# EAGLE design 10bit-adc-and-dac-v2 (EAGLE 8.6.0)
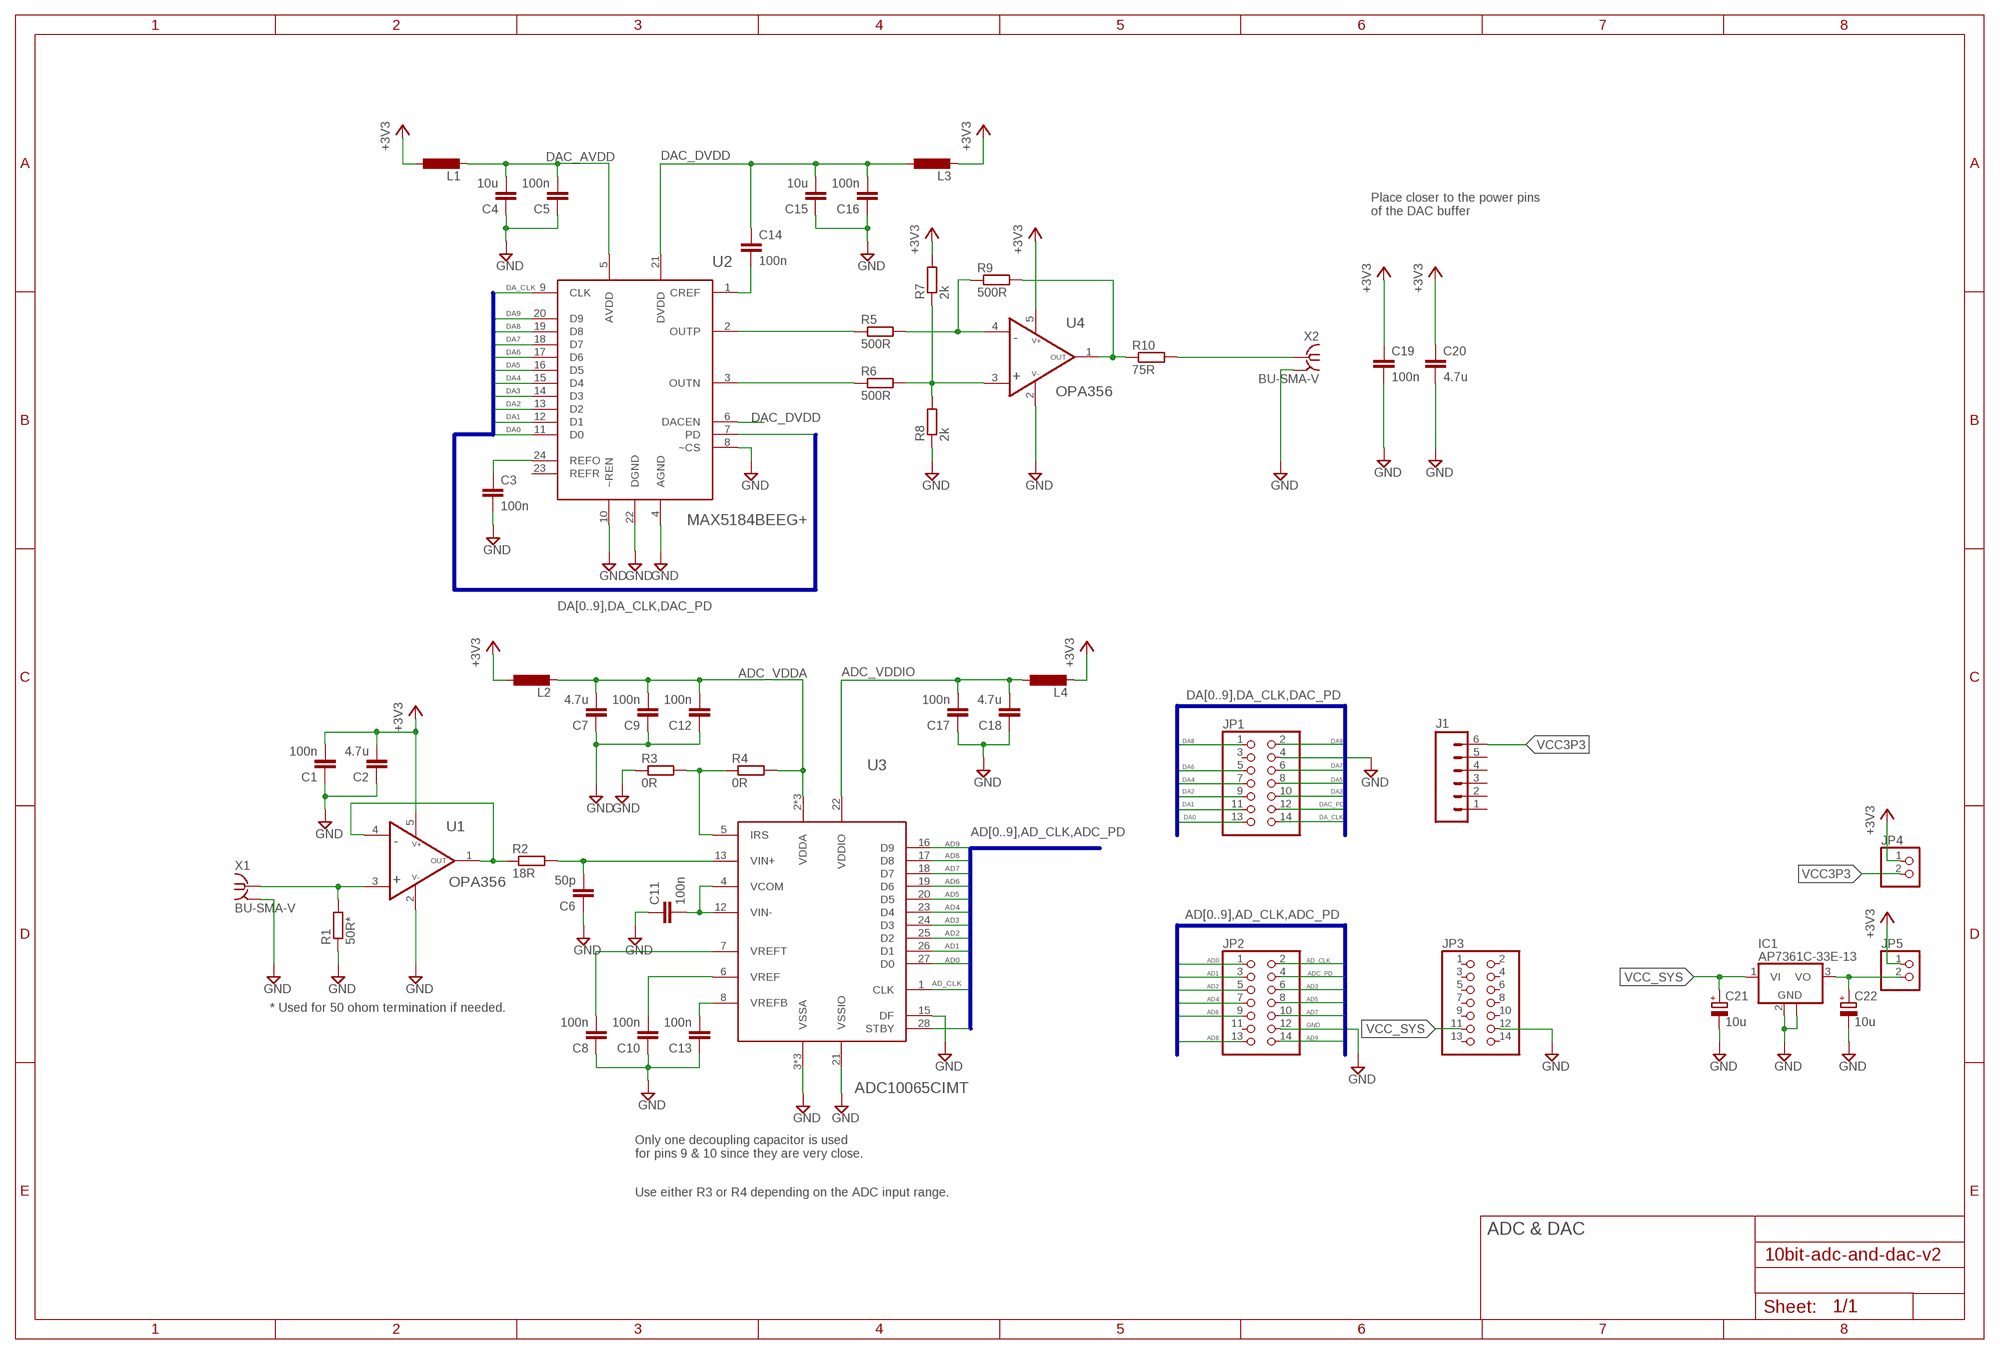
[diagram p0: schematic, sheet 1]

## Parts
C1  100n  C-EUC0805  [C0805]
C2  4.7u  C-EUC0805  [C0805]
C3  100n  C-EUC0805  [C0805]
C4  10u  C-EUC0805  [C0805]
C5  100n  C-EUC0805  [C0805]
C6  50p  C-EUC0805  [C0805]
C7  4.7u  C-EUC0805  [C0805]
C8  100n  C-EUC0805  [C0805]
C9  100n  C-EUC0805  [C0805]
C10  100n  C-EUC0805  [C0805]
C11  100n  C-EUC0805  [C0805]
C12  100n  C-EUC0805  [C0805]
C13  100n  C-EUC0805  [C0805]
C14  100n  C-EUC0805  [C0805]
C15  10u  C-EUC0805  [C0805]
C16  100n  C-EUC0805  [C0805]
C17  100n  C-EUC0805  [C0805]
C18  4.7u  C-EUC0805  [C0805]
C19  100n  C-EUC0805  [C0805]
C20  4.7u  C-EUC0805  [C0805]
C21  10u  CPOL-EUCT3528  [CT3528]
C22  10u  CPOL-EUCT3528  [CT3528]
IC1  AP7361C-33E-13  UA78M33DCY  [SOT223]
J1  M06SILK_FEMALE_PTH  [1X06]
JP1  PINHD-2X7  [2X07]
JP2  PINHD-2X7  [2X07]
JP3  PINHD-2X7  [2X07]
JP4  PINHD-1X2  [1X02]
JP5  PINHD-1X2  [1X02]
L1  L-EUL2012C  [L2012C]
L2  L-EUL2012C  [L2012C]
L3  L-EUL2012C  [L2012C]
L4  L-EUL2012C  [L2012C]
R1  50R*  R-EU_R0805  [R0805]
R2  18R  R-EU_R0805  [R0805]
R3  0R  R-EU_R0805  [R0805]
R4  0R  R-EU_R0805  [R0805]
R5  500R  R-EU_R0805  [R0805]
R6  500R  R-EU_R0805  [R0805]
R7  2k  R-EU_R0805  [R0805]
R8  2k  R-EU_R0805  [R0805]
R9  500R  R-EU_R0805  [R0805]
R10  75R  R-EU_R0805  [R0805]
U1  OPA356  [SOT23-5L]
U2  MAX5184BEEG+  [SOP63P600X175-24N]
U3  ADC10065CIMT  [TSSOP28]
U4  OPA356  [SOT23-5L]
X1  BU-SMA-V  [BU-SMA-V]
X2  BU-SMA-V  [BU-SMA-V]

## Nets
+3V3: C1.2 C2.2 C19.1 C20.1 JP4.1 JP5.1 L1.1 L2.1 L3.2 L4.2 R7.2 U1.5(V+) U4.5(V+)
AD0: JP2.1 U3.27(D0)
AD1: JP2.3 U3.26(D1)
AD2: JP2.5 U3.25(D2)
AD3: JP2.6 U3.24(D3)
AD4: JP2.7 U3.23(D4)
AD5: JP2.8 U3.20(D5)
AD6: JP2.9 U3.19(D6)
AD7: JP2.10 U3.18(D7)
AD8: JP2.13 U3.17(D8)
AD9: JP2.14 U3.16(D9)
AD_CLK: JP2.2 U3.1(CLK)
ADC_PD: JP2.4 U3.28(STBY)
ADC_VDDA: C7.2 C9.2 C12.2 L2.2 R4.2 U3.2(VDDA) U3.9(VDDA) U3.10(VDDA)
ADC_VDDIO: C17.2 C18.2 L4.1 U3.22(VDDIO)
DA0: JP1.13 U2.11(D0)
DA1: JP1.11 U2.12(D1)
DA2: JP1.9 U2.13(D2)
DA3: JP1.10 U2.14(D3)
DA4: JP1.7 U2.15(D4)
DA5: JP1.8 U2.16(D5)
DA6: JP1.5 U2.17(D6)
DA7: JP1.6 U2.18(D7)
DA8: JP1.1 U2.19(D8)
DA9: JP1.2 U2.20(D9)
DA_CLK: JP1.14 U2.9(CLK)
DAC_AVDD: C4.2 C5.2 L1.2 U2.5(AVDD)
DAC_DVDD: C14.1 C15.2 C16.2 L3.1 U2.6(DACEN) U2.21(DVDD)
DAC_PD: JP1.12 U2.7(PD)
GND: C1.1 C2.1 C3.2 C4.1 C5.1 C6.1 C7.1 C8.1 C9.1 C10.1 C11.1 C12.1 C13.1 C15.1 C16.1 C17.1 C18.1 C19.2 C20.2 C21.- C22.- IC1.2(GND) IC1.4(GND) JP1.4 JP2.12 JP3.12 R1.1 R3.1 R8.1 U1.2(V-) U2.4(AGND) U2.8(~CS) U2.10(~REN) U2.22(DGND) U3.3(VSSA) U3.11(VSSA) U3.14(VSSA) U3.15(DF) U3.21(VSSIO) U4.2(V-) X1.2 X1.3 X1.4 X1.5 X2.2 X2.3 X2.4 X2.5
N$2: R2.1 U1.1(OUT) U1.4(IN-)
N$3: R10.2 X2.1
N$4: R1.2 U1.3(IN+) X1.1
N$5: C22.+ IC1.3(VO) JP5.2
N$6: R3.2 R4.1 U3.5(IRS)
N$7: C13.2 U3.8(VREFB)
N$8: C6.2 R2.2 U3.13(VIN+)
N$11: C10.2 U3.6(VREF)
N$13: C3.1 U2.24(REFO)
N$14: C14.2 U2.1(CREF)
N$15: C8.2 U3.7(VREFT)
N$18: C11.2 U3.4(VCOM) U3.12(VIN-)
N$19: R9.2 R10.1 U4.1(OUT)
N$23: R6.2 R7.1 R8.2 U4.3(IN+)
N$24: R5.2 R9.1 U4.4(IN-)
N$25: R5.1 U2.2(OUTP)
N$26: R6.1 U2.3(OUTN)
VCC3P3: J1.6 JP4.2
VCC_SYS: C21.+ IC1.1(VI) JP3.11
Unconnected: J1.1 J1.2 J1.3 J1.4 J1.5 JP1.3 JP2.11 JP3.1 JP3.2 JP3.3 JP3.4 JP3.5 JP3.6 JP3.7 JP3.8 JP3.9 JP3.10 JP3.13 JP3.14 U2.23(REFR)

## Buses
AD[0..9],AD_CLK,ADC_PD
DA[0..9],DA_CLK,DAC_PD

## Notes on the sheet
- Place closer to the power pins
  of the DAC buffer
- * Used for 50 ohom termination if needed.
- Only one decoupling capacitor is used
  for pins 9 & 10 since they are very close.
- Use either R3 or R4 depending on the ADC input range.
- ADC & DAC

## Library data of the parts
C1-C20 = resistor:C-EU: CAPACITOR, European symbol
C21 C22 = rcl:CPOL-EU: POLARIZED CAPACITOR, European symbol; SPICEPREFIX: C
IC1 = linear:UA78M*: POSITIVE-VOLTAGE REGULATORS Source: http://focus.ti.com/lit/ds/symlink/ua78m33.pdf; MF: Diodes Incorporated; MPN: AP7361C-33E-13
J1 = SparkFun-Connectors:M06: Header 6 Standard 6-pin 0.1" header. Use with straight break away headers (SKU : PRT-00116), right angle break away headers (PRT-00553), swiss pins (PRT-00743), machine pins (PRT-00117), and female headers (PRT-00115). Molex polarized connector foot print use with SKU : PRT-08094 with associated crimp pins and housings. NOTES ON THE VARIANTS LOCK and LOCK_LONGPADS... This footprint was designed to help hold the alignment of a through-hole component (i.e. 6-pin header) while soldering it into place. You may notice that each hole has been shifted either up or down by 0.005 of an inch from it's more standard position (which is a perfectly straight line). This slight alteration caused the pins (the squares in the middle) to touch the edges of the holes. Because they are alternating, it causes a "brace" to hold the component in place. 0.005 has proven to be the perfect amount of "off-center" position when using our standard breakaway headers. Although looks a little odd when you look at the bare footprint, once you have a header in there, the alteration is very hard to notice. Also,if you push a header all the way into place, it is covered up entirely on the bottom side. This idea of altering the position of holes to aid alignment will be further integrated into the Sparkfun Library for other footprints. It can help hold any component with 3 or more connection pins.; PROD_ID: CONN-08437
JP1-JP3 = pinhead+:PINHD-2X7: PIN HEADER
JP4 JP5 = pinhead+:PINHD-1X2: PIN HEADER
L1-L4 = resistor:L-EU: INDUCTOR, European symbol; MPN: CIM21J252NE
R1-R10 = resistor:R-EU_: RESISTOR, European symbol
U1 U4 = misc-parts:OPA356: OPAMP; MF: TI; MPN: OPA356AIDBVR
U2 = misc-parts:MAX5184: 10-Bit, 40MHz, Current/Voltage-Output DACs; MF: MAXIM; MPN: MAX5184BEEG+
U3 = misc-parts:ADC10065: 10-Bit, 65-MSPS Analog-to-Digital Converter (ADC); MF: TI; MPN: ADC10065CIMTX/NOPB
X1 X2 = con-coax:BU-SMA-V: FEMALE SMA CONNECTOR Radiall distributor RS 112-3794; MF: TE Connectivity; MPN: 5-1814832-1; OC_FARNELL: unknown; OC_NEWARK: unknown

## Board
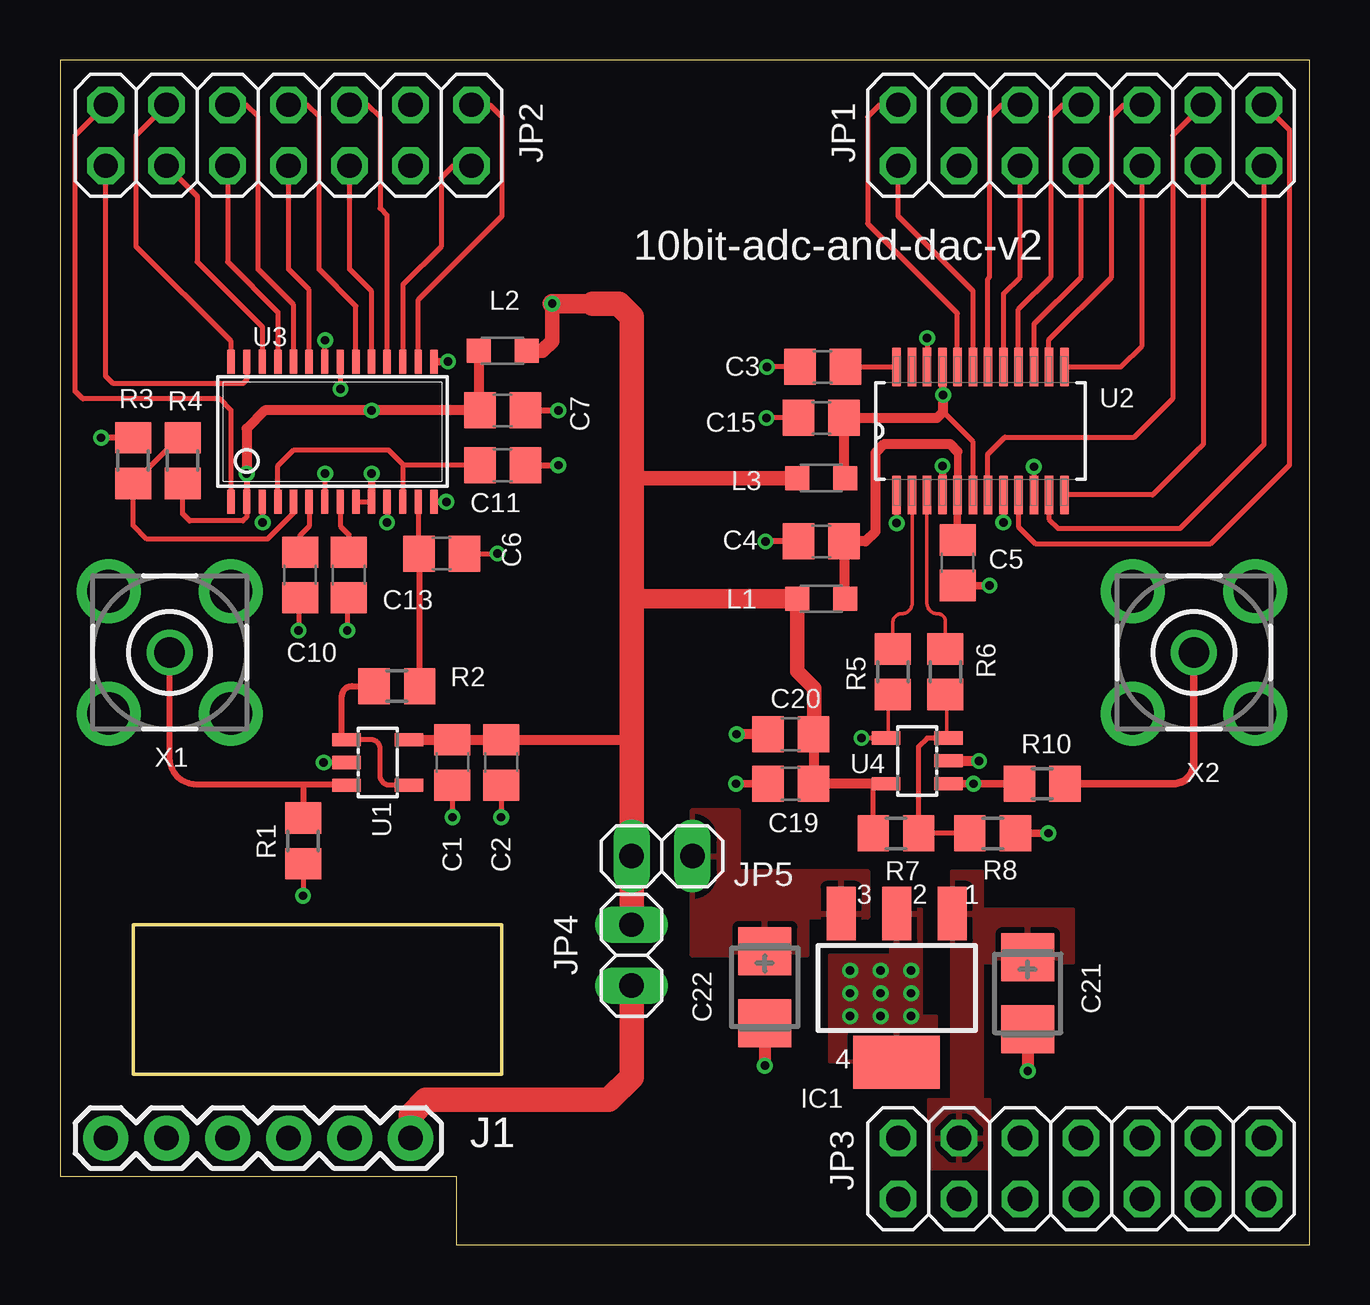
[diagram p1: board, top side]
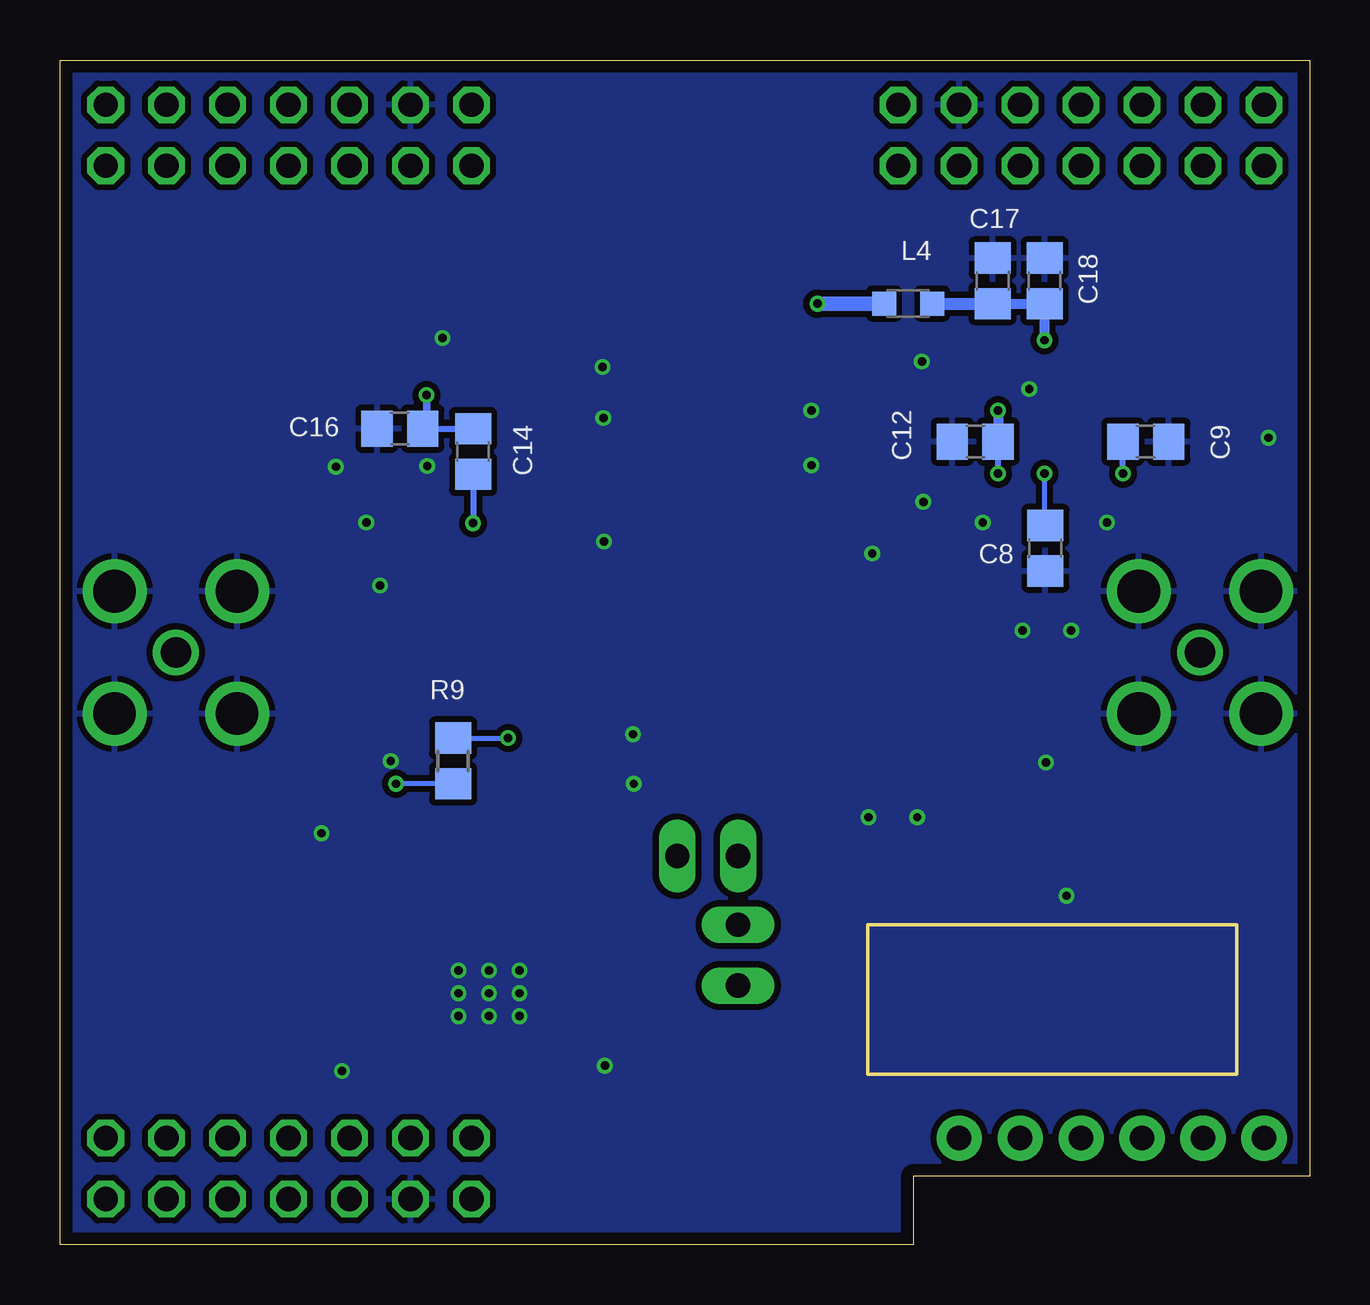
[diagram p2: board, bottom side, seen from below]

Size 52.07 x 49.36 mm. Coordinates in mm from the lower left corner, seen from the top.
Outline: 0,2.86 16.51,2.86 16.51,0 52.07,0 52.07,49.37 0,49.37 0,2.86
Copper layers (1*16): Top 0.035mm / dielectric 1.6mm / Bottom 0.035mm
Design rules "Elecrow-2-layer_PCB_eagle_rule *": minimum track width 6mil, minimum drill 12mil, track to track 6mil, track to pad 8mil, pad to pad 8mil, via to via 12mil, smd to smd 0mil, copper to edge 20mil, drill to drill 10mil, minimum pad ring 6mil, minimum via ring 6mil, stop-mask expansion 0mil, vias tented up to drill 100mil, thermal gap 10mil
Milling: area 3,7.1 to 18.4,13.3

### Footprints (pad centres in the part's own frame; a part is rotated, then mirrored left to right if it is on the bottom)
C0805 = smd 1.3 x 1.5: 1 -0.95,0; 2 0.95,0
CT3528 = smd 2 x 2.2: + -1.5,0; - 1.5,0
SOT223 = smd 1.219 x 2.235: 1 -2.311,-3.099; 2 0,-3.099; 3 2.311,-3.099 | smd 3.6 x 2.2: 4 0,3.099
1X06 = drill 1.016 pad 1.88: 1 0,0; 2 2.54,0; 3 5.08,0; 4 7.62,0; 5 10.16,0; 6 12.7,0
2X07 = drill 1.016 octagon: 1 -7.62,-1.27; 2 -7.62,1.27; 3 -5.08,-1.27; 4 -5.08,1.27; 5 -2.54,-1.27; 6 -2.54,1.27; 7 0,-1.27; 8 0,1.27; 9 2.54,-1.27; 10 2.54,1.27; 11 5.08,-1.27; 12 5.08,1.27; 13 7.62,-1.27; 14 7.62,1.27
1X02 = drill 1.016 long: 1 -1.27,0; 2 1.27,0
L2012C = smd 1 x 1: 1 -1,0; 2 1,0
R0805 = smd 1.3 x 1.5: 1 -0.95,0; 2 0.95,0
SOT23-5L = smd 0.55 x 1.2: 1 -0.95,-1.3; 2 0,-1.3; 3 0.95,-1.3; 4 0.95,1.3; 5 -0.95,1.3
SOP63P600X175-24N = smd 1.6 x 0.356: 1 -2.667,3.505; 2 -2.667,2.845; 3 -2.667,2.235; 4 -2.667,1.575; 5 -2.667,0.965; 6 -2.667,0.305; 7 -2.667,-0.305; 8 -2.667,-0.965; 9 -2.667,-1.575; 10 -2.667,-2.235; 11 -2.667,-2.845; 12 -2.667,-3.505; 13 2.667,-3.505; 14 2.667,-2.845; 15 2.667,-2.235; 16 2.667,-1.575; 17 2.667,-0.965; 18 2.667,-0.305; 19 2.667,0.305; 20 2.667,0.965; 21 2.667,1.575; 22 2.667,2.235; 23 2.667,2.845; 24 2.667,3.505
TSSOP28 = smd 0.305 x 0.991: 1 -4.225,-2.918; 2 -3.575,-2.918; 3 -2.925,-2.918; 4 -2.275,-2.918; 5 -1.625,-2.918; 6 -0.975,-2.918; 7 -0.325,-2.918; 8 0.325,-2.918; 9 0.975,-2.918; 10 1.625,-2.918; 11 2.275,-2.918; 12 2.925,-2.918; 13 3.575,-2.918; 14 4.225,-2.918; 15 4.225,2.918; 16 3.575,2.918; 17 2.925,2.918; 18 2.275,2.918; 19 1.625,2.918; 20 0.975,2.918; 21 0.325,2.918; 22 -0.325,2.918; 23 -0.975,2.918; 24 -1.625,2.918; 25 -2.275,2.918; 26 -2.925,2.918; 27 -3.575,2.918; 28 -4.225,2.918
BU-SMA-V = drill 1.27: 1 0,0 | drill 1.778: 2 -2.55,2.55; 3 2.55,2.55; 4 2.55,-2.55; 5 -2.55,-2.55

### Placement (x,y rotation side)
C1  16.35,20.1 90 top
C2  18.38,20.1 90 top
C3  31.78,36.58 180 top
C4  31.72,29.31 0 top
C5  37.4,28.42 90 top
C6  15.91,28.8 180 top
C7  18.45,34.77 180 top
C8  11.02,29.02 90 bottom
C9  6.83,33.46 180 bottom
C10  10,27.91 90 top
C11  18.45,32.48 180 top
C12  13.94,33.46 0 bottom
C13  12.03,27.91 90 top
C14  34.86,33.05 270 bottom
C15  31.72,34.45 0 top
C16  37.91,34 0 bottom
C17  13.21,40.16 270 bottom
C18  11.05,40.16 270 bottom
C19  30.45,19.21 180 top
C20  30.45,21.27 180 top
C21  40.32,10.48 270 top
C22  29.37,10.73 270 top
IC1  34.86,10.7 180 top
J1  1.91,4.45 0 top
JP1  42.55,46.23 0 top
JP2  9.53,46.23 0 top
JP3  42.55,3.17 180 top
JP4  23.81,12.06 270 top
JP5  25.08,16.19 0 top
L1  31.72,26.92 0 top
L2  18.45,37.24 180 top
L3  31.72,31.94 180 top
L4  16.73,39.21 180 bottom
R1  10.13,16.83 90 top
R2  14.03,23.27 0 top
R3  3.05,32.67 270 top
R4  5.11,32.67 270 top
R5  34.7,23.88 270 top
R6  36.89,23.88 270 top
R7  34.83,17.14 180 top
R8  38.86,17.14 180 top
R9  35.69,20.16 270 bottom
R10  40.93,19.21 0 top
U1  13.24,20.1 270 top
U2  38.35,33.91 90 top
U3  11.36,33.88 0 top
U4  35.72,20.16 90 top
X1  4.57,24.68 0 top
X2  47.24,24.68 0 top

### Tracks (layer width: path | path; a pad name or v marks a point on that pad's centre or on a via)
+3V3  (via drill 0.35)
  Top 0.203: R7.2 33.88,19.12 33.97,19.21
  Top 0.406: U1.5 C1.2 C2.2 23.72,21.05 arc-90 23.81,20.95 | C19.1 31.56,19.21 | C19.1 33.97,19.21 U4.5 | C19.1 | C20.1 C19.1
  Top 0.61: L2.1 20.1,37.24 20.51,37.66 v20.51,39.21 | L3.2 23.81,31.94 23.81,32.07 | L1.1 30.72,23.89 31.43,23.18 31.43,21.31 C20.1
  Top 0.813: v20.51,39.21 22.19,39.21 | 23.94,31.94 23.81,32.07 | L1.1 23.88,26.92 23.81,26.99
  Top 1.016: 22.19,39.21 23.27,39.21 23.81,38.67 23.81,32.07 23.81,26.99 23.81,20.95 JP5.1 JP4.1
  Bottom 0.61: L4.2 v20.51,39.21
AD0
  Top 0.203: JP2.1 1.91,36.2 2.22,35.88 7.62,35.88 7.78,36.04 U3.27
AD1
  Top 0.203: U3.26 8.43,38.24 5.71,40.96 5.71,43.69 JP2.3
AD2
  Top 0.203: U3.25 9.08,38.86 6.99,40.96 JP2.5
AD3
  Top 0.203: JP2.6 7.75,47.5 8.26,46.99 8.26,40.64 9.73,39.16 U3.24
AD4
  Top 0.203: U3.23 10.38,39.78 9.53,40.64 JP2.7
AD5
  Top 0.203: JP2.8 10.29,47.5 10.79,46.99 10.79,40.64 12.33,39.1 U3.20
AD6
  Top 0.203: U3.19 12.98,39.73 12.06,40.64 JP2.9
AD7
  Top 0.203: U3.18 13.63,42.88 13.34,43.18 13.34,46.99 12.83,47.5 JP2.10
AD8
  Top 0.203: JP2.13 16.38,44.96 15.88,44.45 15.88,41.59 14.29,40.01 U3.17
AD9
  Top 0.203: U3.16 14.93,39.38 18.41,42.86 18.41,46.99 17.91,47.5 JP2.14
AD_CLK
  Top 0.203: U3.1 7.13,34.78 6.67,35.24 0.95,35.24 0.64,35.56 0.64,46.23 JP2.2
ADC_PD
  Top 0.203: U3.28 7.13,37.64 3.17,41.59 3.17,46.23 JP2.4
ADC_VDDA  (via drill 0.35)
  Top 0.203: U3.9 U3.10 | 12.98,32.16 v12.99,32.13 | R4.2 5.11,30.45 5.4,30.16 7.62,30.16 7.78,30.32 U3.2
  Top 0.254: U3.2 v7.78,32.13
  Top 0.305: U3.10 12.98,32.16 | U3.2 | 17.52,34.79 C7.2
  Top 0.406: v7.78,32.13 7.78,34 8.54,34.77 v12.99,34.77 C7.2 17.45,34.82 L2.2
  Bottom 0.203: 12.99,32.16 v12.99,32.13
  Bottom 0.254: v7.78,32.13 C9.2 | 12.99,33.5 C12.2 12.99,33.49 v12.99,32.13
  Bottom 0.406: v12.99,34.77 12.99,33.5
ADC_VDDIO  (via drill 0.35)
  Top 0.203: U3.22 11.03,37.67 v11.05,37.69
  Bottom 0.406: v11.05,37.69 C18.2 C17.2
  Bottom 0.508: L4.1 C17.2
DA0
  Top 0.203: U2.11 41.2,30.24 41.59,29.84 46.67,29.84 48.26,31.43 48.58,31.75 50.16,33.34 JP1.13
DA1
  Top 0.203: U2.12 45.53,31.24 47.31,33.02 47.62,33.34 JP1.11
DA2
  Top 0.203: U2.13 44.2,36.58 45.09,37.47 JP1.9
DA3
  Top 0.203: JP1.10 44.32,47.5 43.81,46.99 43.81,40.32 41.2,37.71 U2.14
DA4
  Top 0.203: U2.15 40.59,38.37 42.55,40.32 JP1.7
DA5
  Top 0.203: U2.16 39.93,38.98 41.27,40.32 41.27,46.99 41.78,47.5 JP1.8
DA6
  Top 0.203: U2.17 39.32,39.64 40.01,40.32 JP1.5
DA7
  Top 0.203: JP1.6 39.24,47.5 38.73,46.99 38.73,40.32 38.66,40.25 U2.18
DA8
  Top 0.203: U2.19 38.05,39.74 34.92,42.86 JP1.1
DA9
  Top 0.203: U2.20 37.39,38.81 33.66,42.55 33.66,46.99 34.16,47.5 JP1.2
DA_CLK
  Top 0.203: JP1.14 51.23,46.43 51.23,32.5 47.94,29.21 40.64,29.21 39.93,29.92 U2.9
DAC_AVDD
  Top 0.203: U2.5 37.4,31.23
  Top 0.254: 37.4,31.24 U2.5 37.4,31.25
  Top 0.305: 37.4,31.23 | U2.5 37.37,31.26 | U2.5 C5.2 | 37.4,31.25 U2.5 | 37.4,33.05 37.4,31.25
  Top 0.406: 37.4,33.05 37.08,33.37 34.35,33.37 33.97,32.99 33.97,29.72 33.56,29.3 32.69,29.3 32.68,29.3 C4.2 32.67,26.97 L1.2
DAC_DVDD  (via drill 0.35)
  Top 0.203: U2.6 38.05,33.45 36.8,34.7
  Top 0.305: 36.77,36.56 U2.21 36.78,35.42 v36.8,35.4
  Top 0.406: v36.8,35.4 36.8,34.7 36.54,34.45 C15.2 32.67,31.94 L3.1
  Bottom 0.254: C16.2 C14.1
  Bottom 0.305: v36.8,35.4 36.8,34 C16.2
DAC_PD
  Top 0.203: JP1.12 46.35,46.23 46.35,35.24 44.77,33.66 39.37,33.66 38.66,32.94 U2.7
GND  (via drill 0.35)
  Top 0.203: v36.13,37.78 36.13,36.59 U2.22 | 39.31,31.25 U2.8 39.32,30.11 v39.31,30.1 | 40.58,31.25 U2.10 40.59,32.4 v40.58,32.42 | U3.21 v11.68,35.66 | U3.3 8.43,30.11 v8.45,30.1 | U3.11 v13.63,30.11 v13.62,30.1 | C13.1 11.97,26.89 v11.97,25.59 | C10.1 9.94,26.89 v9.94,25.59 | C3.2 v29.46,36.58 | C6.1 v18.22,28.8 | U1.2 v10.99,20.1 | C1.1 v16.35,17.81 | C2.1 v18.38,17.81 | C15.1 v29.43,34.45 | R1.1 v10.13,14.54
  Top 0.254: U3.14 v16.09,30.96 v16.1,30.96 | C11.1 v20.77,32.48 | C7.1 v20.77,34.77 | C4.1 v29.4,29.3 | R3.1 v1.72,33.62 v1.71,33.62
  Top 0.305: R8.1 v41.18,17.14 | U2.4 36.78,32.44 v36.77,32.45 | v38.73,27.46 C5.1 | v16.16,36.8 U3.15 | C19.2 v28.16,19.21
  Top 0.406: U4.2 v38.29,20.16 | C20.2 v28.19,21.27
  Top 0.508: C22.- v29.37,7.46 | C21.- v40.32,7.24
  other vias: 32.92,11.43 32.92,10.48 32.92,9.53 34.19,9.53 35.46,9.53 35.46,10.48 34.19,10.48 34.19,11.43 35.46,11.43
  pour Bottom (isolate 0.254, rank 2): 0.25,48.83 51.56,48.77 51.56,0.25 0.25,0.25
  pour Top: 32.07,7.62 32.07,12.06 34.61,12.06 34.61,13.97 35.88,13.97 35.88,9.53 36.51,9.53 36.51,7.62
N$2
  Top 0.203: U1.4 13.74,19.15 arc-90 13.34,19.56 13.34,20.67 arc90 12.95,21.05 U1.1
  Top 0.254: U1.1 arc-90 11.75,21.24 11.75,22.86 arc-90 12.16,23.27 R2.1
N$3
  Top 0.305: R10.2 46.39,19.21 arc90 47.24,20.07 X2.1
N$4
  Top 0.203: U1.3 U1.3 arc90 11.91,19.18 | R1.2 10.16,17.78
  Top 0.254: 11.91,19.18 10.16,19.18 | 10.16,19.18 5.68,19.18 arc-90 4.57,20.29 X1.1 | 10.16,17.78 10.16,19.18
N$5
  pour Top: 26.35,18.1 28.26,18.1 28.26,15.56 33.66,15.56 33.66,13.65 31.11,13.65 31.11,12.06 26.35,12.06
N$6
  Top 0.203: R4.1 4.95,33.62 R3.2 3.05,29.97 3.62,29.4 8.64,29.4 9.73,30.5 U3.5
N$7
  Top 0.203: U3.8 11.65,30.93 11.68,30.9 11.68,29.94 12.03,29.59 C13.2
N$8
  Top 0.203: 14.95,30.93 arc90 U3.13 14.93,28.82 C6.2
  Top 0.254: R2.2 14.98,28.82 14.93,28.82
N$11
  Top 0.203: U3.6 10.38,29.94 10,29.56 C10.2
N$13
  Top 0.203: U2.24 C3.1
N$14  (via drill 0.35)
  Top 0.203: U2.1 34.85,30.08 v34.86,30.07
  Bottom 0.254: C14.2 v34.86,30.07
N$15  (via drill 0.35)
  Top 0.203: U3.7 11.05,30.98 v11.05,32.13
  Bottom 0.203: C8.2 11.05,30 v11.05,32.13
N$18
  Top 0.203: 14.28,32.52 U3.12 | 14.28,32.52 13.68,33.12 9.75,33.12 9.08,32.45 U3.4 | 14.28,32.52 14.32,32.48 C11.2
N$19  (via drill 0.35)
  Top 0.203: U4.1
  Top 0.305: U4.1 v38.07,19.21 R10.1
  Bottom 0.203: R9.2 v38.07,19.21
N$23
  Top 0.152: R6.2 36.96,22.93 36.96,21.11
  Top 0.203: U4.3 36.99,21.11 | U4.3 37.08,21.11 | R8.2 R7.1 35.78,20.76 36.13,21.11 36.96,21.11 U4.3
N$24  (via drill 0.35)
  Top 0.152: R5.2 34.51,22.93 34.51,21.11
  Top 0.203: 34.51,21.11 U4.4 v33.4,21.11
  Bottom 0.203: R9.1 v33.4,21.11
N$25
  Top 0.152: R5.1 34.7,25.94 arc-90 35.05,26.29 arc90 35.51,26.75 U2.2
N$26
  Top 0.152: R6.1 36.89,25.97 arc90 36.58,26.29 arc-90 36.12,26.75 U2.3
VCC3P3
  Top 1.016: J1.6 14.61,5.4 15.24,6.03 22.86,6.03 23.81,6.99 JP4.2
VCC_SYS
  Top 0.813: 37.15,13.77 IC1.1
  pour Top: 37.15,15.56 38.42,15.56 38.42,13.97 42.23,13.97 42.23,11.75 38.42,11.75 38.42,6.03 38.73,6.03 38.73,3.17 36.2,3.17 36.2,6.03 37.15,6.03

### Text on the board
tPlace: 10bit-adc-and-dac-v2